# EAGLE design Pithy Screen (EAGLE 9.6.2)
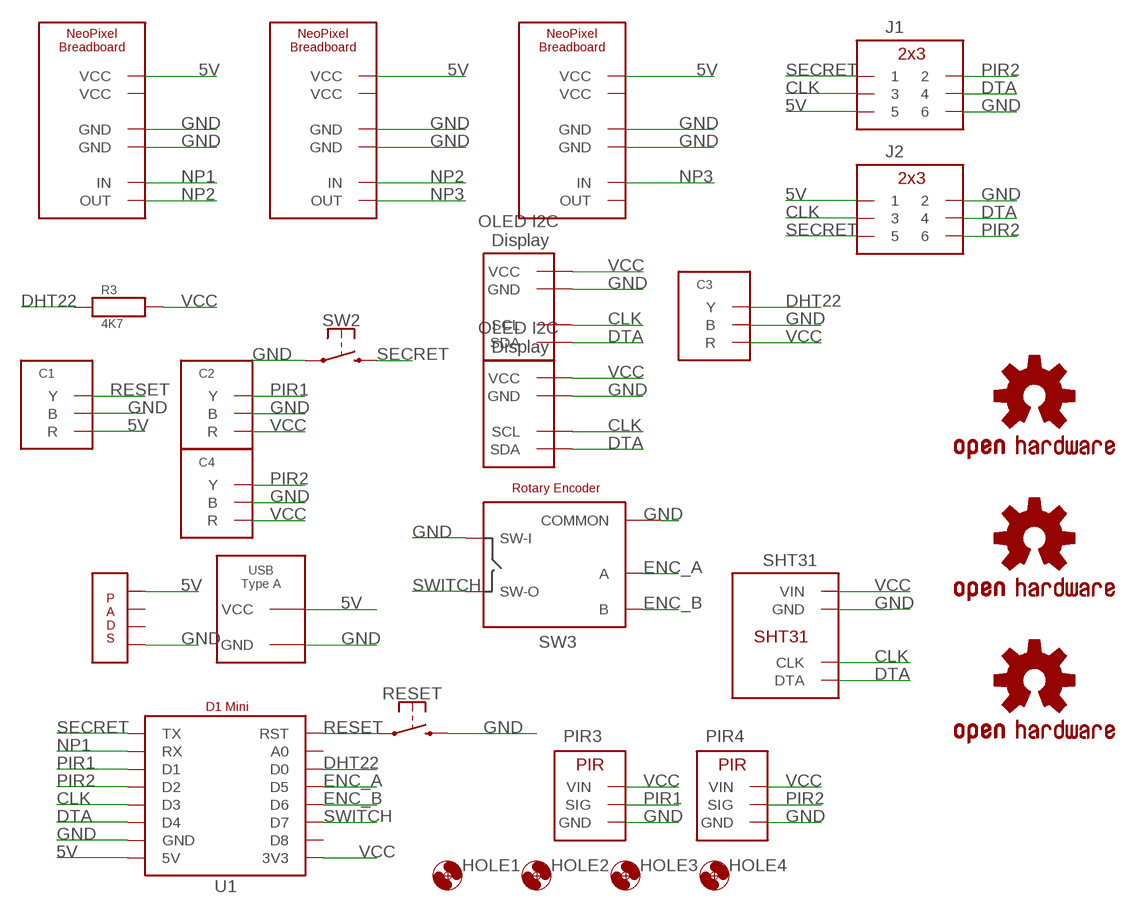
[diagram p0: schematic, sheet 1]

## Parts
C1  JST_2MM_3PIN  [JST_2MM_3PIN]
C2  JST_2MM_3PIN  [JST_2MM_3PIN]
C3  JST_2MM_3PIN  [JST_2MM_3PIN]
C4  JST_2MM_3PIN  [JST_2MM_3PIN]
HOLE1  HOLE_3.2  [HOLE_3.2]
HOLE2  HOLE_3.2  [HOLE_3.2]
HOLE3  HOLE_3.2  [HOLE_3.2]
HOLE4  HOLE_3.2  [HOLE_3.2]
J1  DIL_2X03FEMALE  [2X3-RAF]
J2  DIL_2X03FEMALE  [2X3-RAF]
LOGO1  OSHW-LOGOL  [OSHW-LOGO-L]
LOGO2  OSHW-LOGOM  [OSHW-LOGO-M]
LOGO3  OSHW-LOGOS  [OSHW-LOGO-S]
NP1  NEOPIXEL_BREADBOARD  [NEOPIXEL_BREADBOARD]
NP2  NEOPIXEL_BREADBOARD  [NEOPIXEL_BREADBOARD]
NP3  NEOPIXEL_BREADBOARD  [NEOPIXEL_BREADBOARD]
PIR3  PIR45DEG  [PIR_45DEG]
PIR4  PIR45DEG  [PIR_45DEG]
R3  4K7  1/4W_RESISTOR  [1/4W_RESISTOR]
RESET  SPDT_MOMENTARY  [SPDT_RIGHT_ANGLE]
SHT31  SHT31RIGHT_ANGLED  [SHT31_RIGHT_ANGLE]
SW2  SPDT_MOMENTARY  [SPDT_RIGHT_ANGLE]
SW3  ENCODER  ROTARY_ENCODER  [ROTARY_ENCODER]
U1  D1_MINI  [D1_MINI]
U2  OLED_I2C_0.9"VCC_LEFT  [OLED_I2C_0.9"_ALT]
U3  OLED_I2C_0.9"VCC_LEFT  [OLED_I2C_0.9"_ALT]
U$1  USB_TYPE_A  [USB_TYPE_A_BACKWARDS]
U$2  PADS_4  [PADS_4]

## Nets
5V [power]: C1.RED(R) J1.5 J2.1 NP1.VCC NP2.VCC NP3.VCC U1.5V U$1.VCC U$2.P$4
CLK: J1.3 J2.3 SHT31.CLK U1.D3 U2.SCL U3.SCL
DHT22: C3.YELLOW(Y) R3.P$1 U1.D0
DTA: J1.4 J2.4 SHT31.DTA U1.D4 U2.SDA U3.SDA
ENC_A: SW3.A U1.D5
ENC_B: SW3.B U1.D6
GND: C1.BLACK(B) C2.BLACK(B) C3.BLACK(B) C4.BLACK(B) J1.6 J2.2 NP1.GND NP1.GND@2(GND) NP2.GND NP2.GND@2(GND) NP3.GND NP3.GND@2(GND) PIR3.GND PIR4.GND RESET.2 SHT31.GND SW2.1 SW3.C(COMMON) SW3.SW+(SW-I) U1.GND U2.GND U3.GND U$1.GND U$2.P$1
NP1: NP1.IN U1.RX
NP2: NP1.OUT NP2.IN
NP3: NP2.OUT NP3.IN
PIR1: C2.YELLOW(Y) PIR3.SIG U1.D1
PIR2: C4.YELLOW(Y) J1.2 J2.6 PIR4.SIG U1.D2
RESET: C1.YELLOW(Y) RESET.1 U1.RST
SECRET: J1.1 J2.5 SW2.2 U1.TX
SWITCH: SW3.SW-(SW-O) U1.D7
VCC [comms]: C2.RED(R) C3.RED(R) C4.RED(R) PIR3.VCC(VIN) PIR4.VCC(VIN) R3.P$2 SHT31.VIN U1.3V3 U2.VCC U3.VCC
Unconnected: NP1.VCC@2(VCC) NP2.VCC@2(VCC) NP3.OUT NP3.VCC@2(VCC) U1.A0 U1.D8 U$2.P$2 U$2.P$3

## Library data of the parts
C1-C4 = ioios:JST_2MM_3PIN
HOLE1-HOLE4 = JESP:HOLE_3.2
J1 J2 = ioios:DIL_2X03
LOGO1-LOGO3 = ioios:OSHW-LOGO: Open-Source Hardware (OSHW) Logo This logo indicates the piece of hardware it is found on incorporates a OSHW license and/or adheres to the definition of open source hardware found here: http://freedomdefined.org/OSHW
NP1-NP3 = ioios:NEOPIXEL_BREADBOARD
PIR3 PIR4 = ioios:PIR
R3 = ioios:1/4W_RESISTOR
RESET SW2 = ioios:SPDT_MOMENTARY
SHT31 = ioios:SHT31
SW3 = JESP:ROTARY_ENCODER
U1 = ioios:D1_MINI
U2 U3 = ioios:OLED_I2C_0.9"
U$1 = ioios:USB_TYPE_A
U$2 = ioios:PADS_4

## Net classes
1 power: width 0.203 mm, clearance 0.254 mm
2 comms: width 0.203 mm, clearance 0.203 mm

## Board
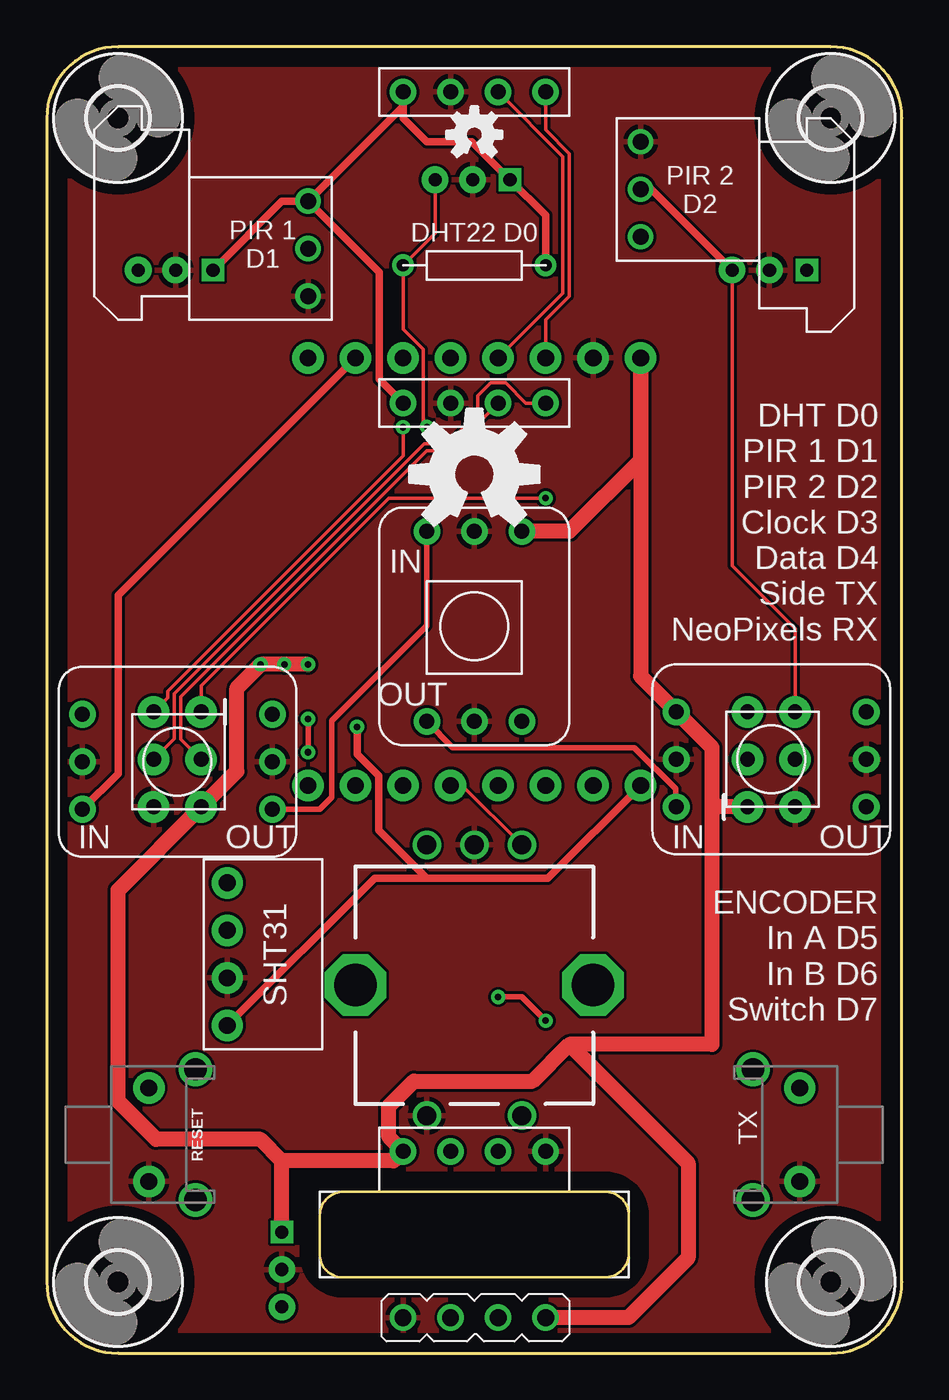
[diagram p1: board, top side]
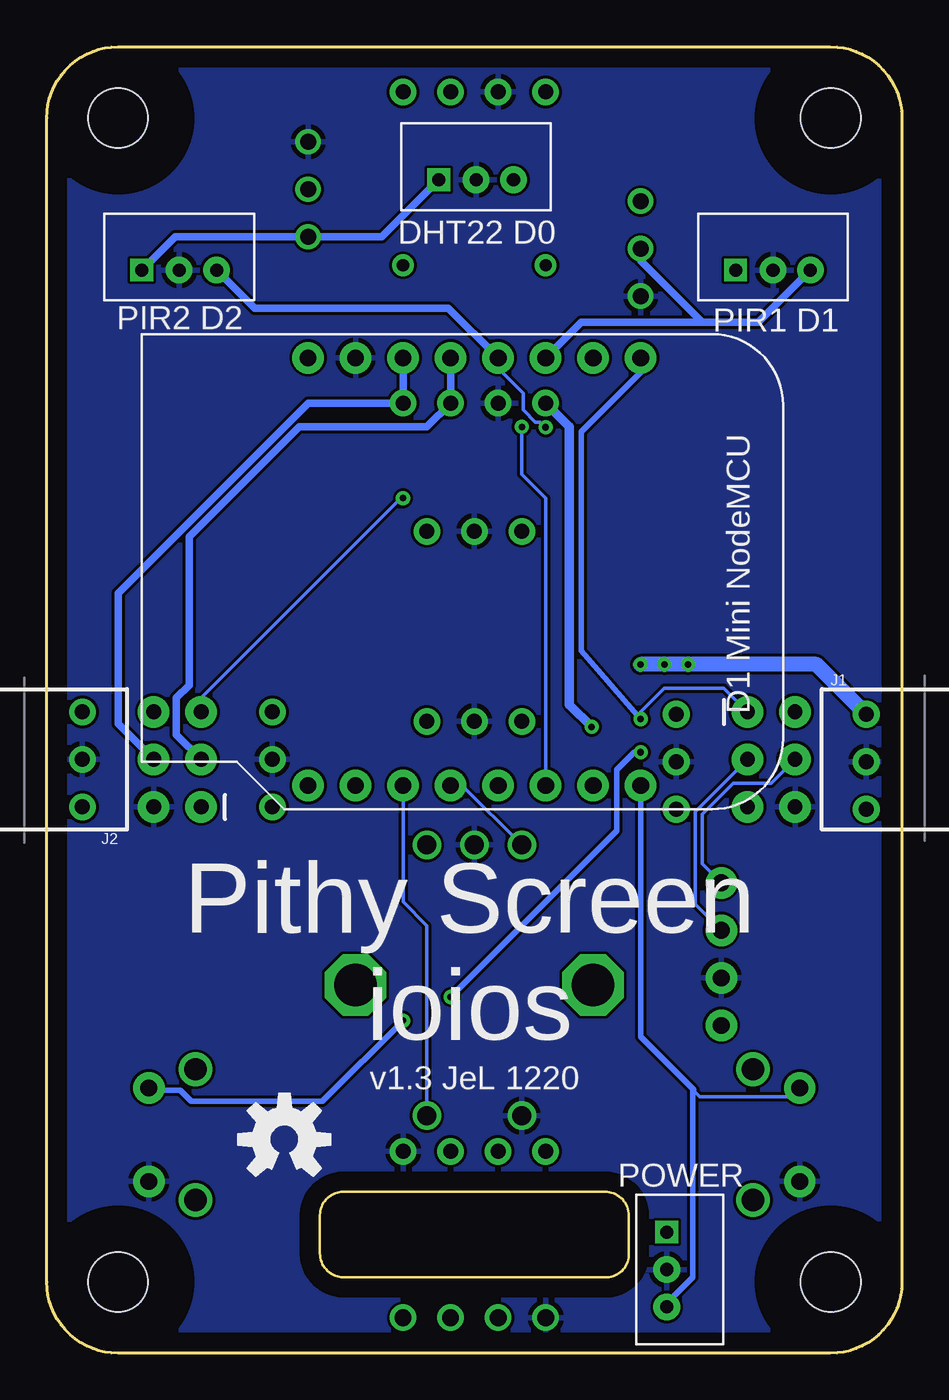
[diagram p2: board, bottom side, seen from below]

Size 45.72 x 69.85 mm. Coordinates in mm from the lower left corner, seen from the top.
Outline: 0,3.81 arc90 3.81,0 41.91,0 arc90 45.72,3.81 45.72,66.04 arc90 41.91,69.85 3.81,69.85 arc90 0,66.04 0,3.81
Copper layers (1*16): Top 0.035mm / dielectric 0.93mm / Bottom 0.035mm
Design rules "default *": minimum track width 6mil, minimum drill 0.35mm, track to track 6mil, track to pad 6mil, pad to pad 6mil, via to via 6mil, smd to smd 6mil, copper to edge 40mil, drill to drill 6mil, minimum pad ring 10mil, minimum via ring 8mil, stop-mask expansion 4mil, vias tented up to drill 0mil, thermal gap 10mil

### Footprints (pad centres in the part's own frame; a part is rotated, then mirrored left to right if it is on the bottom)
JST_2MM_3PIN = drill 0.7 pad 1.422: BLACK 2,-0.508; YELLOW 4,-0.508 | drill 0.7 square: RED 0,-0.508
HOLE_3.2 = hole 3.2: 0,0
2X3-RAF = drill 0.8 pad 1.676: 1 -1.27,5.08; 2 1.27,5.08; 3 -1.27,2.54; 4 1.27,2.54; 5 -1.27,0; 6 1.27,0
NEOPIXEL_BREADBOARD = drill 0.8 pad 1.422: GND 3.81,11.43; GND@2 3.81,1.27; IN 1.27,11.43; OUT 1.27,1.27; VCC 6.35,11.43; VCC@2 6.35,1.27
PIR_45DEG = drill 0.85: GND 5.08,0; SIG 2.54,0; VCC 0,0
1/4W_RESISTOR = drill 0.65: P$1 -3.81,0; P$2 3.81,0
SPDT_RIGHT_ANGLE = drill 0.9 pad 1.676: 1 -2.5,0; 2 2.5,0 | drill 1.2 pad 1.676: ANCHOR1 -3.5,2.5; ANCHOR2 3.5,2.5
SHT31_RIGHT_ANGLE = drill 0.9 pad 1.676: CLK 5.08,0; DTA 7.62,0; GND 2.54,0; VIN 0,0
ROTARY_ENCODER = drill 1.016: A 7.493,-2.54; B 7.493,2.54; C 7.493,0; SW+ -6.985,2.54; SW- -6.985,-2.54 | drill 2.286 octagon: ANC1 0,6.35; ANC2 0,-6.35
D1_MINI = drill 0.9 pad 1.676: 3V3 24.13,8.89; 5V 1.27,8.89; A0 24.13,24.13; D0 24.13,21.59; D1 1.27,21.59; D2 1.27,19.05; D3 1.27,16.51; D4 1.27,13.97; D5 24.13,19.05; D6 24.13,16.51; D7 24.13,13.97; D8 24.13,11.43; GND 1.27,11.43; RST 24.13,26.67; RX 1.27,24.13; TX 1.27,26.67
OLED_I2C_0.9"_ALT = drill 0.8 pad 1.422: GND 2.54,0; SCL 5.08,0; SDA 7.62,0; VCC 0,0
USB_TYPE_A_BACKWARDS = drill 0.8 pad 1.422: GND 7.62,0; P$2 2.54,0; P$3 5.08,0; VCC 0,0
PADS_4 = drill 0.9: P$1 0,0; P$2 2.54,0; P$3 5.08,0; P$4 7.62,0

### Placement (x,y rotation side)
C1  12.06,6.48 270 bottom
C2  8.89,58.42 0 bottom
C3  24.77,63.25 0 bottom
C4  40.64,58.42 0 bottom
HOLE1  3.81,3.81 0 top
HOLE2  3.81,66.04 0 top
HOLE3  41.91,66.04 0 top
HOLE4  41.91,3.81 0 top
J1  6.99,29.21 0 bottom
J2  38.73,34.29 180 bottom
LOGO1  22.86,46.99 0 top
LOGO2  33.02,11.43 0 bottom
LOGO3  22.86,65.15 0 top
NP1  13.34,27.81 90 top
NP2  19.05,32.51 0 top
NP3  45.09,27.94 90 top
PIR3  13.97,61.59 270 top
PIR4  31.75,59.69 90 top
R3  22.86,58.17 0 top
RESET  5.46,11.68 270 top
SHT31  9.65,17.53 90 top
SW2  40.26,11.68 90 top
SW3  22.86,19.68 90 top
U1  40.64,54.48 270 bottom
U2  19.05,67.44 0 top
U3  19.05,50.8 0 top
U$1  19.05,10.79 0 top
U$2  19.05,1.91 0 top

### Tracks (layer width: path | path; a pad name or v marks a point on that pad's centre or on a via)
5V  (via drill 0.35)
  Top 0.813: 27.94,16.51 35.57,16.51 35.57,29.21 | 27.94,16.51 34.29,10.16 34.29,5.1 31.09,1.91 U$2.P$4 | 27.94,16.51 25.98,14.55 19.63,14.55 18.29,13.21 18.29,11.56 U$1.VCC 18.54,10.29 12.57,10.29 | 35.57,29.21 35.57,32.37 NP3.VCC 31.75,36.2 U1.5V 31.75,47.75 27.94,43.94 NP2.VCC | C1.RED 12.57,10.29 | J2.1 35.57,29.21 | v13.97,36.83 v12.7,36.83 v11.43,36.83 10.16,35.56 10.16,31.11 J1.5 3.81,24.77 3.81,13.46 5.84,11.43 11.43,11.43 12.57,10.29
  Bottom 0.813: NP1.VCC 4.57,36.83 v11.43,36.83 v12.7,36.83 v13.97,36.83
CLK
  Top 0.2: J1.3 8.24,31.75 7.16,32.82 7.16,35.1 20.32,48.26 21.59,48.26 U3.SCL | U1.D3 27.59,56.67 27.59,63.98 U2.SCL
  Bottom 0.2: J1.3 11.05,28.96 11.05,24 SHT31.CLK
  Bottom 0.406: J2.3 38.79,33.07 38.79,35.04 38.1,35.72 38.1,43.66 32.23,49.53 25.4,49.53 U3.SCL U1.D3
DHT22  (via drill 0.35)
  Top 0.2: C3.YELLOW 20.77,59.88 R3.P$1 19.05,54.76 20.14,53.66 20.14,49.71 v20.32,49.53
  Bottom 0.2: v20.32,49.53 20.32,46.99 19.05,45.72 U1.D0
DTA
  Top 0.2: J1.4 6.81,32.85 6.81,35.25 20.17,48.61 21.44,48.61 23.04,50.21 23.04,51.2 23.73,51.89 24.53,51.89 25.62,50.8 U3.SDA | U1.D4 26.67,55.24 27.94,56.52 27.94,64.14 26.67,65.41 U2.SDA
  Bottom 0.2: J1.4 6.99,30.48 9.02,30.48 10.67,28.83 10.67,26.16 SHT31.DTA
  Bottom 0.406: J2.4 41.91,33.66 41.91,40.64 31.75,50.8 U3.SDA U1.D4
ENC_A
  Top 0.2: SW3.A 22.23,30.35 U1.D5
ENC_B
  Bottom 0.2: SW3.B 23.5,30.35 U1.D6
GND
  pour Top: 0,0 0,69.85 45.72,69.85 45.72,0
  pour Bottom: 0,0 0,69.85 45.72,69.85 45.72,0
NP1
  Top 0.406: NP1.IN 3.81,30.99 3.81,40.51 U1.RX
NP2
  Top 0.305: NP1.OUT 14.61,29.08 15.25,29.73 15.25,33.82 20.32,38.89 NP2.IN
NP3
  Top 0.305: NP3.IN 33.62,29.24 33.62,30.18 31.41,32.38 21.72,32.38 NP2.OUT
PIR1
  Bottom 0.406: U1.D1 17.14,55.12 10.67,55.12 | C2.YELLOW 7.68,55.12 10.67,55.12 | PIR3.SIG 13.97,58.42 10.67,55.12
PIR2  (via drill 0.35)
  Top 0.2: C4.YELLOW 36.64,42.1 40.01,38.73 J2.6 | J1.2 6.46,35.03 6.46,35.4 19.05,47.99 v19.05,49.51
  Top 0.406: PIR4.SIG 32.32,62.23 C4.YELLOW
  Bottom 0.2: v19.05,49.51 19.33,49.79 19.6,49.79 20.25,50.43 20.25,51.33 21.59,52.67 U1.D2
  Bottom 0.406: U1.D2 24.26,55.88 34.61,55.88 C4.YELLOW
RESET
  Bottom 0.2: C1.YELLOW 12.57,2.67 | RESET.1 5.93,13.72 10.79,13.72 11.18,14.1
  Bottom 0.305: U1.RST 13.97,16.93 11.14,14.1 11.18,14.1 11.18,4.06 12.57,2.67
SECRET  (via drill 0.35)
  Top 0.2: J1.1 8.26,35.7 18.28,45.72 v26.67,45.72
  Top 0.305: v13.97,33.91 v13.97,32.13 | v24.13,19.05 25.4,19.05 v26.67,17.78
  Bottom 0.2: v26.67,45.72 26.8,45.72 37.47,35.05 J2.5 | v13.97,33.91 13.97,34.29 12.7,35.56 9.53,35.56 J1.1
  Bottom 0.305: U1.TX 13.97,52.45 17.14,49.28 17.14,37.56 v13.97,33.91 | v13.97,32.13 14.32,32.13 15.24,31.21 15.24,27.94 v24.13,19.05 | SW2.2 40.13,14.06 38.59,14.06 38,13.47 30.98,13.47 v26.67,17.78
SWITCH
  Bottom 0.2: SW3.SW- 25.4,22.86 26.67,24.13 U1.D7 26.67,30.61
VCC  (via drill 0.35)
  Top 0.406: PIR3.VCC 19.05,66.67 U2.VCC 19.05,66.04 20.32,64.77 22.73,64.77 C3.RED 26.67,60.83 R3.P$2 | C2.RED 12.57,61.59 PIR3.VCC | PIR3.VCC 17.78,57.78 17.78,52.07 U3.VCC | v16.59,33.49 16.59,32.03 17.75,30.87 17.75,27.96 20.32,25.4 | 20.32,25.4 26.8,25.4 U1.3V3 | 20.32,25.4 17.53,25.4 SHT31.VIN
  Bottom 0.406: C4.RED 38.86,59.69 PIR4.VCC 27.81,59.69 C3.RED
  Bottom 0.508: U3.VCC 17.78,49.53 17.78,34.68 v16.59,33.49

### Text on the board
bPlace: DHT22 D0 | PIR1 D1 | PIR2 D2 | Pithy Screen / ioios | v1.3 JeL 1220 | POWER
tNames: PIR 2 / D2 | DHT22 D0 | PIR 1 / D1 | DHT D0 / PIR 1 D1 / PIR 2 D2 / Clock D3 / Data D4 / Side TX / NeoPixels RX | IN | OUT | IN | OUT | IN | OUT | ENCODER / In A D5 / In B D6 / Switch D7 | TX